# Altium project GPS_TRACKER.PrjPcb (part 1 of 2)
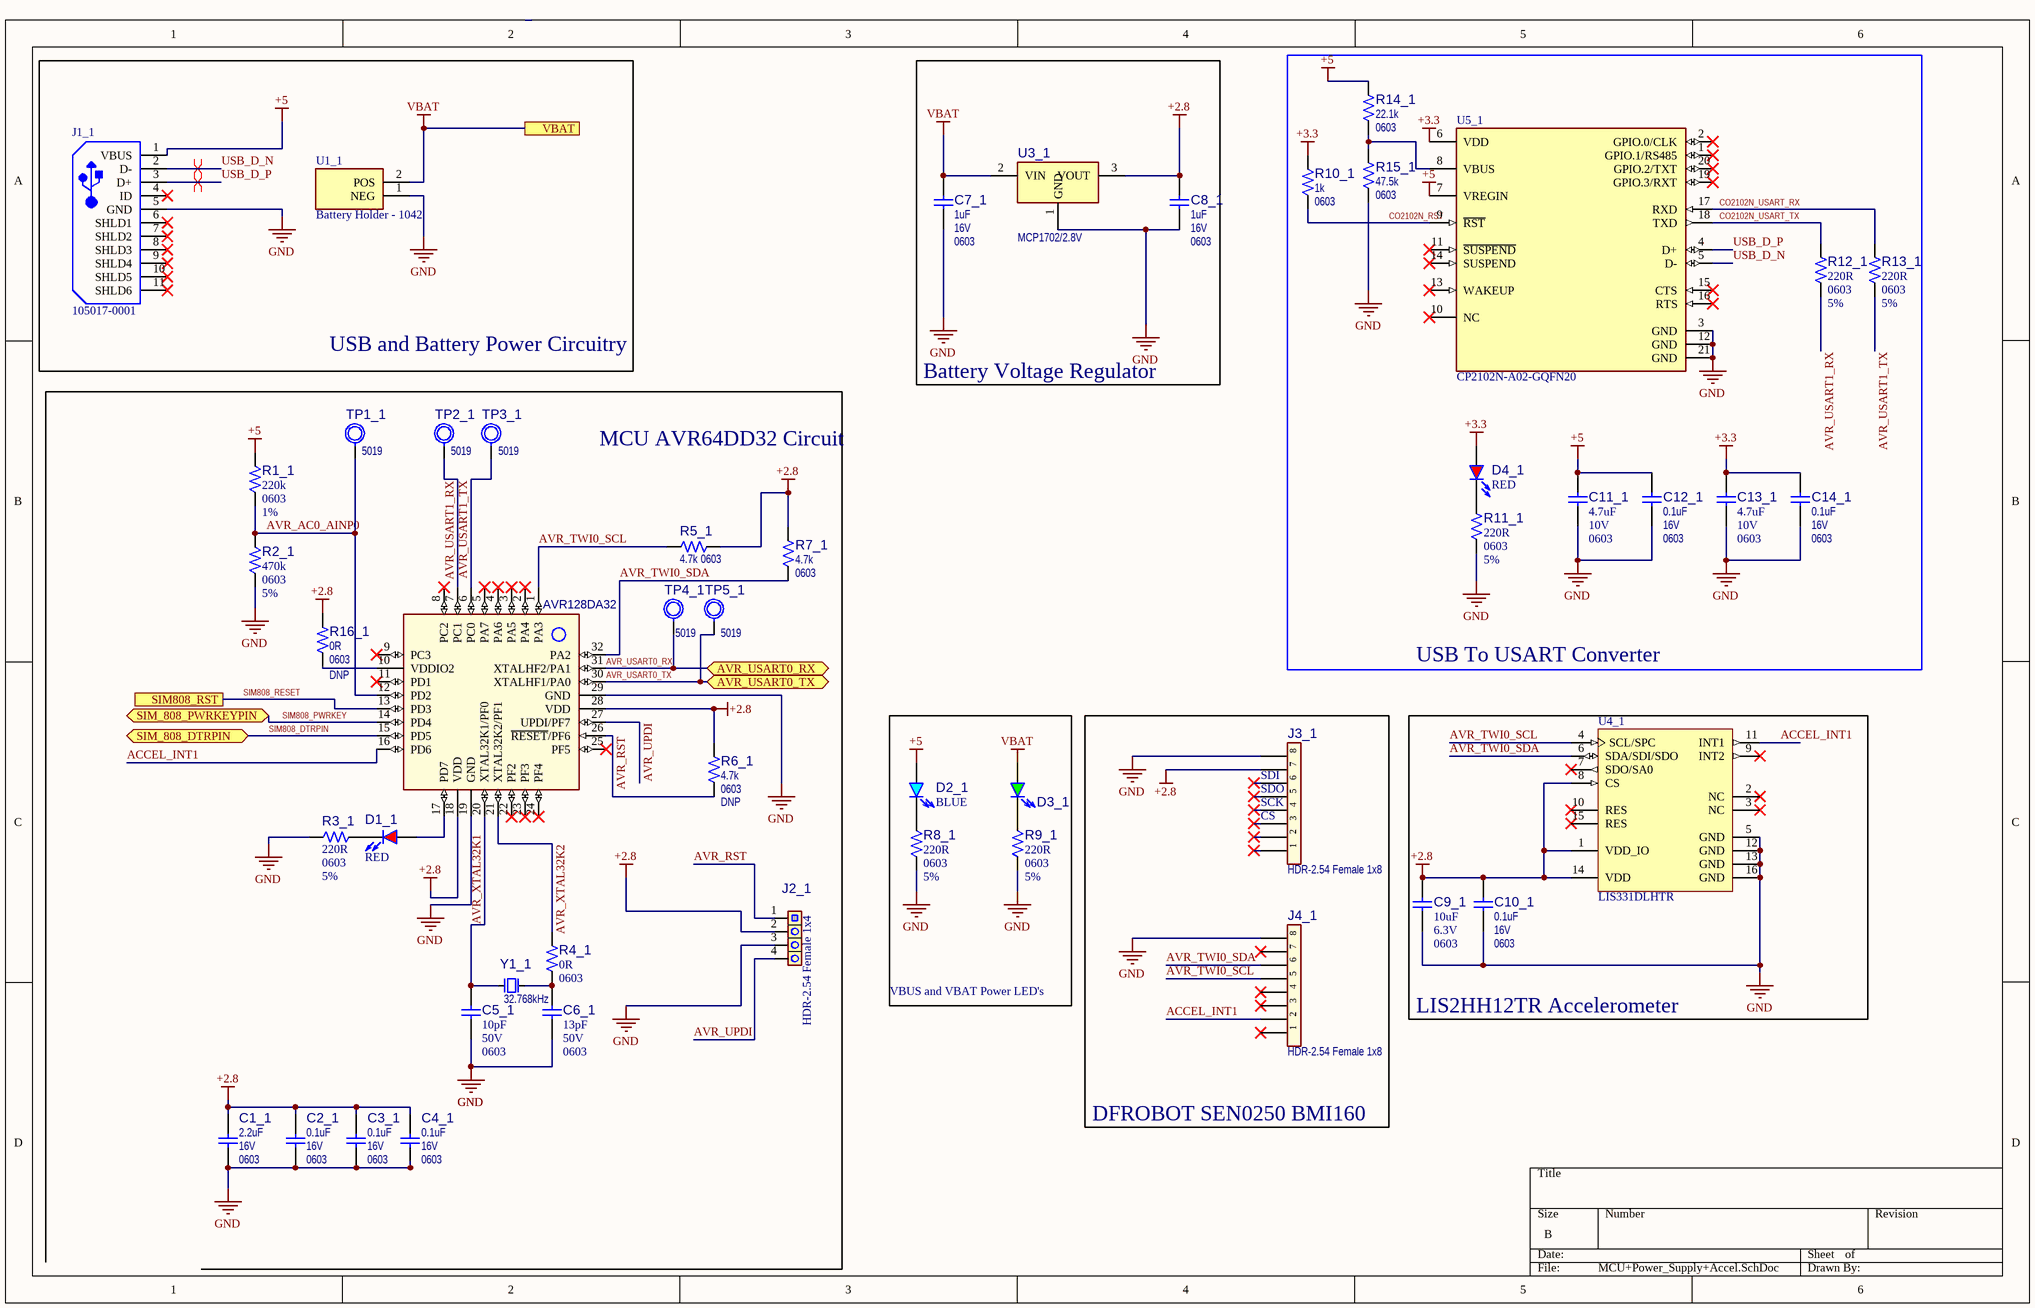
[diagram p0: MCU+Power_Supply+Accel.SchDoc]
2 sheets, 90 parts. Net scope: flat (ports and power ports of the same name join across sheets).
Board file: GPS_TRACKER.PcbDoc
Sheets:
  MCU+Power_Supply+Accel.SchDoc
  SIM808+RF.SchDoc

## Sheet MCU+Power_Supply+Accel.SchDoc
size B; SheetNumber: 1; SheetTotal: 2

### Parts
AVR128DA32  AVR128DA32-E/PT  [TQFP-32_7x7]  (value not drawn)
C1_1  value 2.2uF  Voltage: 16V  Package: 0603  [CAP_C_0603]  (hidden comment: Capacitor NP)
C2_1  value 0.1uF  Voltage: 16V  Package: 0603  [CAP_C_0603]  (hidden comment: Capacitor NP)
C3_1  value 0.1uF  Voltage: 16V  Package: 0603  [CAP_C_0603]  (hidden comment: Capacitor NP)
C4_1  value 0.1uF  Voltage: 16V  Package: 0603  [CAP_C_0603]  (hidden comment: Capacitor NP)
C5_1  value 10pF  Voltage: 50V  Package: 0603  [CAP_C_0603]  (hidden comment: Capacitor NP)
C6_1  value 13pF  Voltage: 50V  Package: 0603  [CAP_C_0603]  (hidden comment: Capacitor NP)
C7_1  value 1uF  Voltage: 16V  Package: 0603  [CAP_C_0603]  (hidden comment: Capacitor NP)
C8_1  value 1uF  Voltage: 16V  Package: 0603  [CAP_C_0603]  (hidden comment: Capacitor NP)
C9_1  value 10uF  Voltage: 6.3V  Package: 0603  [CAP_C_0603]  (hidden comment: Capacitor NP)
C10_1  value 0.1uF  Voltage: 16V  Package: 0603  [CAP_C_0603]  (hidden comment: Capacitor NP)
C11_1  value 4.7uF  Voltage: 10V  Package: 0603  [CAP_C_0603]  (hidden comment: Capacitor NP)
C12_1  value 0.1uF  Voltage: 16V  Package: 0603  [CAP_C_0603]  (hidden comment: Capacitor NP)
C13_1  value 4.7uF  Voltage: 10V  Package: 0603  [CAP_C_0603]  (hidden comment: Capacitor NP)
C14_1  value 0.1uF  Voltage: 16V  Package: 0603  [CAP_C_0603]  (hidden comment: Capacitor NP)
D1_1  value RED  [LED_0603_RED]  (hidden comment: LED_red)
D2_1  value BLUE  [LED_0603_Blue]  (hidden comment: LED_blue)
D3_1  LED_green_true  [LED_0603_Green]  (value not drawn)
D4_1  value RED  [LED_0603_RED]  (hidden comment: LED_red)
J1_1  105017-0001  [USB-MICRO-B_V]
J2_1  value HDR-2.54 Female 1x4  [HDR_F_2.54_1x4_U_TH_V_SAM_SSW-104-01-G-S]  (hidden comment: Header 1x4)
J3_1  value HDR-2.54 Female 1x8  [HDR_F_2.54_1x8]  (hidden comment: Header 1x8)
J4_1  value HDR-2.54 Female 1x8  [HDR_F_2.54_1x8]  (hidden comment: Header 1x8)
R1_1  value 220k  Package: 0603  Tolerance: 1%  [RES_C_0603]  (hidden comment: Resistor)
R2_1  value 470k  Package: 0603  Tolerance: 5%  [RES_C_0603]  (hidden comment: Resistor)
R3_1  value 220R  Package: 0603  Tolerance: 5%  [RES_C_0603]  (hidden comment: Resistor)
R4_1  value 0R  Package: 0603  [RES_C_0603]  (hidden comment: Resistor)
R5_1  value 4.7k  Package: 0603  [RES_C_0603]  (hidden comment: Resistor)
R6_1  value 4.7k  Package: 0603  Populated: DNP  [RES_C_0603]  (hidden comment: Resistor)
R7_1  value 4.7k  Package: 0603  [RES_C_0603]  (hidden comment: Resistor)
R8_1  value 220R  Package: 0603  Tolerance: 5%  [RES_C_0603]  (hidden comment: Resistor)
R9_1  value 220R  Package: 0603  Tolerance: 5%  [RES_C_0603]  (hidden comment: Resistor)
R10_1  value 1k  Package: 0603  [RES_C_0603]  (hidden comment: Resistor)
R11_1  value 220R  Package: 0603  Tolerance: 5%  [RES_C_0603]  (hidden comment: Resistor)
R12_1  value 220R  Package: 0603  Tolerance: 5%  [RES_C_0603]  (hidden comment: Resistor)
R13_1  value 220R  Package: 0603  Tolerance: 5%  [RES_C_0603]  (hidden comment: Resistor)
R14_1  value 22.1k  Package: 0603  [RES_C_0603]  (hidden comment: Resistor)
R15_1  value 47.5k  Package: 0603  [RES_C_0603]  (hidden comment: Resistor)
R16_1  value 0R  Package: 0603  Populated: DNP  [RES_C_0603]  (hidden comment: Resistor)
TP1_1  value 5019  [TP_3.8x2.03_SMD]  (hidden comment: Test Point)
TP2_1  value 5019  [TP_3.8x2.03_SMD]  (hidden comment: Test Point)
TP3_1  value 5019  [TP_3.8x2.03_SMD]  (hidden comment: Test Point)
TP4_1  value 5019  [TP_3.8x2.03_SMD]  (hidden comment: Test Point)
TP5_1  value 5019  [TP_3.8x2.03_SMD]  (hidden comment: Test Point)
U1_1  Battery Holder - 1042  [KEYSTONE-1042]
U3_1  value MCP1702/2.8V  [SOT-89-3]  (hidden comment: MCP170X SOT-89-3_TO-92-3)
U4_1  LIS331DLHTR  [STM-LGA16-3X3X1]
U5_1  CP2102N-A02-GQFN20  [FP-CP2102N-A02-GQFN20-MFG]
Y1_1  value 32.768kHz  [CRYSTAL_FX135A_L3.2W1.5H0.9]  (hidden comment: Crystal 2 Pins)

### Blocks framed on the sheet
USB and Battery Power Circuitry: J1_1 U1_1
Battery Voltage Regulator: C7_1 C8_1 U3_1
USB To USART Converter: C11_1 C12_1 C13_1 C14_1 D4_1 R10_1 R11_1 R12_1 R13_1 R14_1 R15_1 U5_1
VBUS and VBAT Power LED's: D2_1 D3_1 R8_1 R9_1
DFROBOT SEN0250 BMI160: J3_1 J4_1
LIS2HH12TR Accelerometer: C9_1 C10_1 U4_1

### Ports
AVR_USART0_RX (bidir), AVR_USART0_TX (bidir), SIM808_RST, SIM_808_DTRPIN (bidir), SIM_808_PWRKEYPIN (bidir), VBAT

### Nets
+2.8: AVR128DA32.18(VDD) AVR128DA32.28(VDD) C1_1.2 C2_1.2 C3_1.2 C4_1.2 C8_1.2 C9_1.2 C10_1.2 J2_1.2 J3_1.7 R5_1.2 R6_1.2 R7_1.2 R16_1.1 U3_1.3(VOUT) U4_1.1(VDD_IO) U4_1.8(CS) U4_1.14(VDD)
+3.3: C13_1.2 C14_1.2 D4_1.1(A) R10_1.2 U5_1.6(VDD)
+5: C11_1.2 C12_1.2 D2_1.1(A) J1_1.1(VBUS) R1_1.2 R14_1.2 U5_1.7(VREGIN)
GND: AVR128DA32.19(GND) AVR128DA32.29(GND) C1_1.1 C2_1.1 C3_1.1 C4_1.1 C5_1.1 C6_1.1 C7_1.1 C8_1.1 C9_1.1 C10_1.1 C11_1.1 C12_1.1 C13_1.1 C14_1.1 J1_1.5(GND) J2_1.3 J3_1.8 J4_1.8 R2_1.2 R3_1.2 R8_1.1 R9_1.1 R11_1.1 R15_1.1 U1_1.1(NEG) U3_1.1(GND) U4_1.5(GND) U4_1.12(GND) U4_1.13(GND) U4_1.16(GND) U5_1.3(GND) U5_1.12(GND) U5_1.21(GND)
VBAT: C7_1.2 D3_1.1(A) U1_1.2(POS) U3_1.2(VIN) ; port VBAT
ACCEL_INT1: AVR128DA32.16(PD6) J4_1.2 U4_1.11(INT1)
AVR_AC0_AINP0: AVR128DA32.12(PD2) R1_1.1 R2_1.1 TP1_1.1
AVR_RST: AVR128DA32.26(~{RESET}/PF6) J2_1.1 R6_1.1
AVR_TWI0_SCL: AVR128DA32.1(PA3) J4_1.5 R5_1.1 U4_1.4(SCL/SPC)
AVR_TWI0_SDA: AVR128DA32.32(PA2) J4_1.6 R7_1.1 U4_1.6(SDA/SDI/SDO)
AVR_UPDI: AVR128DA32.27(UPDI/PF7) J2_1.4
AVR_USART0_RX: AVR128DA32.31(XTALHF2/PA1) TP4_1.1 ; port AVR_USART0_RX
AVR_USART0_TX: AVR128DA32.30(XTALHF1/PA0) TP5_1.1 ; port AVR_USART0_TX
AVR_USART1_RX: AVR128DA32.7(PC1) R12_1.1 TP2_1.1
AVR_USART1_TX: AVR128DA32.6(PC0) R13_1.1 TP3_1.1
AVR_XTAL32K1: AVR128DA32.20(XTAL32K1/PF0) C5_1.2 Y1_1.1(Osc1)
AVR_XTAL32K2: AVR128DA32.21(XTAL32K2/PF1) R4_1.2
CO2102N_RST: R10_1.1 U5_1.9(~{RST})
CO2102N_USART_RX: R13_1.2 U5_1.17(RXD)
CO2102N_USART_TX: R12_1.2 U5_1.18(TXD)
SIM808_DTRPIN: AVR128DA32.15(PD5) ; port SIM_808_DTRPIN
SIM808_PWRKEY: AVR128DA32.14(PD4) ; port SIM_808_PWRKEYPIN
SIM808_RESET: AVR128DA32.13(PD3) ; port SIM808_RST  [project net ]
USB_D_N: J1_1.2(D-) U5_1.5(D-)
USB_D_P: J1_1.3(D+) U5_1.4(D+)
NetAVR128DA32_10: AVR128DA32.10(VDDIO2) R16_1.2
NetAVR128DA32_17: AVR128DA32.17(PD7) D1_1.1(A)
NetC6_1_2: C6_1.2 R4_1.1 Y1_1.2(Osc2)
NetD1_1_2: D1_1.2(K) R3_1.1
NetD2_1_2: D2_1.2(K) R8_1.2
NetD3_1_2: D3_1.2(K) R9_1.2
NetD4_1_2: D4_1.2(K) R11_1.2
NetR14_1_1: R14_1.1 R15_1.2 U5_1.8(VBUS)

Not connected (* = marked no-connect by the designer): AVR128DA32 2(PA4)* 3(PA5)* 4(PA6)* 5(PA7)* 8(PC2)* 9(PC3)* 11(PD1)* 22(PF2)* 23(PF3)* 24(PF4)* 25(PF5)*; J1_1 4(ID)* 6(SHLD1)* 7(SHLD2)* 8(SHLD3)* 9(SHLD4)* 10(SHLD5)* 11(SHLD6)*; J3_1 1* 2* 3* 4* 5* 6*; J4_1 1* 3* 4* 7*; U4_1 2(NC)* 3(NC)* 7(SDO/SA0)* 9(INT2)* 10(RES)* 15(RES)*; U5_1 1(GPIO.1/RS485)* 2(GPIO.0/CLK)* 10(NC)* 11(~{SUSPEND})* 13(WAKEUP)* 14(SUSPEND)* 15(CTS)* 16(RTS)* 19(GPIO.3/RXT)* 20(GPIO.2/TXT)*

### Layout directives
differential pair; net class DIFF_USB: USB_D_N, USB_D_P

### Notes on the sheet
- MCU AVR64DD32 Circuit
- (near J3_1) SDI
- (near J3_1) SDO
- (near J3_1) SCK
- (near J3_1) CS

### Library data of the parts
AVR128DA32 = MIC9190: Manufacturer 1: Microchip Technology; Manufacturer Part Number 1: AVR64DD32-I/PT; Description_: MCHP MCU 8-bit 24MHz 64KB 8KB AVR64DD32-I/PT TQFP-32; Dev Tools Status: Production; Owner: Simen Tanbergmoen; Populated: YES; MCHP-ID: MIC9190; Symbol: AVR64DD32 TQFP-32; Type: 8-Bit; Status: MCL Design; Revision: 1; Category: MCHP-Microcontroller; ComponentLink1URL: https://chn-vm-apps.microchip.com/mchprepo/parts/Datasheets/AVR64DD3228 Advance DataSheet=1=Microchip PDF=en-US.pdf; ComponentLink1Description: SVN Datasheet; ComponentLink2URL: C:\ALTIUM_WORK\00001_MCHP-CDB\Datasheets\AVR64DD3228 Advance DataSheet=1=Microchip PDF=en-US.pdf; ComponentLink2Description: Local Datasheet; ComponentLink3URL: C:\ALTIUM_WORK\00001_MCHP-CDB\Library\LibraryRefs\AVR64DD32 TQFP-32.SchLib; ComponentLink3Description: Open Symbol; ComponentLink4URL: C:\ALTIUM_WORK\00001_MCHP-CDB\Library\Footprints\TQFP-32_7x7.PcbLib; ComponentLink4Description: Open Footprint; ComponentLink5Description: Open Footprint 2; ComponentLink6Description: Open Footprint 3; ComponentLink7Description: Open Footprint 4; Supplier 1: Microchip Technology; Supplier Part Number 1: AVR64DD32-I/PT; Operating Temperature: -40C to +85C; Quantity Override: 1
C1_1 = CAP0597: Manufacturer 1: TDK Corporation; Manufacturer Part Number 1: C1608X5R1C225K080AB; Description_: CAP CER 2.2uF 16V 10% X5R SMD 0603; Dev Tools Status: Production; Tolerance: 10%; Temperature Coefficient: X5R; Type: Ceramic; Populated: Yes; MCHP-ID: CAP0597; Revision: 6; Symbol: Capacitor NP; Status: MCL Design; ComponentLink1URL: https://chn-vm-apps.microchip.com/mchprepo/parts/Datasheets/general_B11.pdf; ComponentLink1Description: SVN Datasheet; ComponentLink2URL: C:\ALTIUM_WORK\00001_MCHP-CDB\Datasheets\general_B11.pdf; ComponentLink2Description: Local Datasheet; ComponentLink3URL: C:\ALTIUM_WORK\00001_MCHP-CDB\Library\LibraryRefs\Capacitor NP.SchLib; ComponentLink3Description: Open Symbol; ComponentLink4URL: C:\ALTIUM_WORK\00001_MCHP-CDB\Library\Footprints\CAP_C_0603.PcbLib; ComponentLink4Description: Open Footprint; ComponentLink5Description: Open Footprint 2; ComponentLink6Description: Open Footprint 3; ComponentLink7Description: Open Footprint 4; Operating Temperature: -55C to +85C; Category: Capacitor; Supplier 1: Digi-Key; Supplier Part Number 1: 445-5157-1-ND; Quantity Override: 1
C2_1 C3_1 C4_1 C10_1 C12_1 C14_1 = CAP0011: Manufacturer 1: Taiyo Yuden; Manufacturer Part Number 1: EMK107B7104KA-T; Description_: CAP CER 0.1uF 16V 10% X7R SMD 0603; Dev Tools Status: Production; Tolerance: 10%; Temperature Coefficient: X7R; Type: Ceramic; Owner: Cristian Papuc; Populated: YES; MCHP-ID: CAP0011; Revision: 6; Symbol: Capacitor NP; Status: MCL Design; ComponentLink1URL: https://chn-vm-apps.microchip.com/mchprepo/parts/Datasheets/nmc2.pdf; ComponentLink1Description: SVN Datasheet; ComponentLink2URL: C:\ALTIUM_WORK\00001_MCHP-CDB\Datasheets\nmc2.pdf; ComponentLink2Description: Local Datasheet; ComponentLink3URL: C:\ALTIUM_WORK\00001_MCHP-CDB\Library\LibraryRefs\Capacitor NP.SchLib; ComponentLink3Description: Open Symbol; ComponentLink4URL: C:\ALTIUM_WORK\00001_MCHP-CDB\Library\Footprints\CAP_C_0603.PcbLib; ComponentLink4Description: Open Footprint; ComponentLink5Description: Open Footprint 2; ComponentLink6Description: Open Footprint 3; ComponentLink7Description: Open Footprint 4; Operating Temperature: -55C to +125C; Category: Capacitor; Manufacturer 2: D1_Murata Electronics North America; Manufacturer Part Number 2: GCM188R71C104KA37D; Manufacturer 3: D5_AVX; Manufacturer Part Number 3: 0603YC104KAT2A; Manufacturer 4: Samsung Electro-Mechanics; Manufacturer Part Number 4: CL10B104KO8NNNC; Manufacturer 5: Taiyo Yuden; Manufacturer Part Number 5: EMK107B7104KA-T; Manufacturer 6: Würth Elektronik; Manufacturer Part Number 6: 885012206046; Manufacturer 7: Yageo; Manufacturer Part Number 7: CC0603KRX7R7BB104; Supplier 1: Newark; Supplier Part Number 1: 86H5248; Supplier 2: Digi-Key; Supplier Part Number 2: 490-4774-1-ND; Supplier 3: Digi-Key; Supplier Part Number 3: 478-1239-1-ND; Supplier 4: Digi-Key; Supplier Part Number 4: 1276-1005-1-ND; Supplier 5: Digi-Key; Supplier Part Number 5: 587-1240-1-ND; Supplier 6: Digi-Key; Supplier Part Number 6: 732-7965-1-ND; Supplier 7: Digi-Key; Supplier Part Number 7: 311-1088-1-ND; Quantity Override: 1
C5_1 = CAP2488: Manufacturer 1: Würth Elektronik; Manufacturer Part Number 1: 885012006051; Description_: CAP CER 10pF 5% 50V C0G SMD 0603; Dev Tools Status: Design; Tolerance: 5%; Temperature Coefficient: C0G; Type: Ceramic; Owner: Cristina Salanti; Populated: YES; MCHP-ID: CAP2488; Revision: 2; Symbol: Capacitor NP; Status: MCL Design; ComponentLink1URL: https://chn-vm-apps.microchip.com/mchprepo/parts/Datasheets/885012006051.pdf; ComponentLink1Description: SVN Datasheet; ComponentLink2URL: C:\ALTIUM_WORK\00001_MCHP-CDB\Datasheets\885012006051.pdf; ComponentLink2Description: Local Datasheet; ComponentLink3URL: C:\ALTIUM_WORK\00001_MCHP-CDB\Library\LibraryRefs\Capacitor NP.SchLib; ComponentLink3Description: Open Symbol; ComponentLink4URL: C:\ALTIUM_WORK\00001_MCHP-CDB\Library\Footprints\CAP_C_0603.PcbLib; ComponentLink4Description: Open Footprint; ComponentLink5Description: Open Footprint 2; ComponentLink6Description: Open Footprint 3; ComponentLink7Description: Open Footprint 4; Operating Temperature: -55C to +125C; Category: Capacitor; Supplier 1: Digi-Key; Supplier Part Number 1: 732-7793-1-ND; Quantity Override: 1
C6_1 = CAP2468: Manufacturer 1: Yageo; Manufacturer Part Number 1: CC0603GRNPO9BN130; Description_: Ceramic capacitor, SMD 0603, 13pF, NP0, 50V, +/-2%; Dev Tools Status: Design; Tolerance: 2%; Temperature Coefficient: NP0; Type: Ceramic; Owner: Dragos Danaila; Populated: YES; MCHP-ID: CAP2468; Revision: 2; Symbol: Capacitor NP; Status: MCL Design; ComponentLink1URL: https://chn-vm-apps.microchip.com/mchprepo/parts/Datasheets/UPY-GP_NP0_16V-to-50V_18.pdf; ComponentLink1Description: SVN Datasheet; ComponentLink2URL: C:\ALTIUM_WORK\00001_MCHP-CDB\Datasheets\UPY-GP_NP0_16V-to-50V_18.pdf; ComponentLink2Description: Local Datasheet; ComponentLink3URL: C:\ALTIUM_WORK\00001_MCHP-CDB\Library\LibraryRefs\Capacitor NP.SchLib; ComponentLink3Description: Open Symbol; ComponentLink4URL: C:\ALTIUM_WORK\00001_MCHP-CDB\Library\Footprints\CAP_C_0603.PcbLib; ComponentLink4Description: Open Footprint; ComponentLink5Description: Open Footprint 2; ComponentLink6Description: Open Footprint 3; ComponentLink7Description: Open Footprint 4; Operating Temperature: -55C to +125C; Category: Capacitor; Supplier 1: Digi-Key; Supplier Part Number 1: 311-3919-1-ND; Quantity Override: 1
C7_1 C8_1 = CAP0265: Manufacturer 1: D5_AVX; Manufacturer Part Number 1: 0603YD105KAT2A; Description_: CAP CER 1uF 16V 10% X5R SMD 0603; Dev Tools Status: Production; Tolerance: 10%; Temperature Coefficient: X5R; Type: Ceramic; Populated: Yes; MCHP-ID: CAP0265; Revision: 6; Symbol: Capacitor NP; Status: MCL Design; ComponentLink1URL: https://chn-vm-apps.microchip.com/mchprepo/parts/Datasheets/smccp.pdf; ComponentLink1Description: SVN Datasheet; ComponentLink2URL: C:\ALTIUM_WORK\00001_MCHP-CDB\Datasheets\smccp.pdf; ComponentLink2Description: Local Datasheet; ComponentLink3URL: C:\ALTIUM_WORK\00001_MCHP-CDB\Library\LibraryRefs\Capacitor NP.SchLib; ComponentLink3Description: Open Symbol; ComponentLink4URL: C:\ALTIUM_WORK\00001_MCHP-CDB\Library\Footprints\CAP_C_0603.PcbLib; ComponentLink4Description: Open Footprint; ComponentLink5Description: Open Footprint 2; ComponentLink6Description: Open Footprint 3; ComponentLink7Description: Open Footprint 4; Operating Temperature: -55C to +85C; Category: Capacitor; Manufacturer 2: KEMET; Manufacturer Part Number 2: C0603C105K4PACTU; Manufacturer 3: TDK Corporation; Manufacturer Part Number 3: C1608X5R1C105K080AA; Manufacturer 4: Vishay; Manufacturer Part Number 4: VJ0603G105KXJCW1BC; Manufacturer 5: Yageo; Manufacturer Part Number 5: CC0603KRX5R7BB105; Supplier 1: Digi-Key; Supplier Part Number 1: 478-1249-1-ND; Supplier 2: Digi-Key; Supplier Part Number 2: 399-5090-1-ND; Supplier 3: Digi-Key; Supplier Part Number 3: 445-1416-1-ND; Supplier 4: Digi-Key; Supplier Part Number 4: 720-1851-1-ND; Supplier 5: Digi-Key; Supplier Part Number 5: 311-1444-1-ND; Quantity Override: 1
C9_1 = CAP0533: Manufacturer 1: AVX; Manufacturer Part Number 1: 06036D106MAT2A; Description_: CAP CER 10uF 6.3V 20% X5R SMD 0603; Dev Tools Status: Production; Tolerance: 20%; Temperature Coefficient: X5R; Type: Ceramic; Populated: Yes; MCHP-ID: CAP0533; Revision: 1; Symbol: Capacitor NP; Status: MCL Design; ComponentLink1URL: https://chn-vm-apps.microchip.com/mchprepo/parts/Datasheets/smccp.pdf; ComponentLink1Description: SVN Datasheet; ComponentLink2URL: C:\ALTIUM_WORK\00001_MCHP-CDB\Datasheets\smccp.pdf; ComponentLink2Description: Local Datasheet; ComponentLink3URL: C:\ALTIUM_WORK\00001_MCHP-CDB\Library\LibraryRefs\Capacitor NP.SchLib; ComponentLink3Description: Open Symbol; ComponentLink4URL: C:\ALTIUM_WORK\00001_MCHP-CDB\Library\Footprints\CAP_C_0603.PcbLib; ComponentLink4Description: Open Footprint; ComponentLink5Description: Open Footprint 2; ComponentLink6Description: Open Footprint 3; ComponentLink7Description: Open Footprint 4; Operating Temperature: -55C to +85C; Category: Capacitor; Manufacturer 2: KEMET; Manufacturer Part Number 2: C0603C106M9PACTU; Manufacturer 3: Murata; Manufacturer Part Number 3: GRM188R60J106ME47D; Manufacturer 4: TDK Corporation; Manufacturer Part Number 4: C1608X5R0J106M080AB; Manufacturer 5: TDK Corporation; Manufacturer Part Number 5: C1608X5R0J106M; Supplier 1: Digi-Key; Supplier Part Number 1: 478-5318-2-ND; Supplier 2: Digi-Key; Supplier Part Number 2: 399-5504-1-ND; Supplier 3: Digi-Key; Supplier Part Number 3: 445-3472-1-ND; Supplier 4: Digi-Key; Supplier Part Number 4: 445-4112-1-ND; Quantity Override: 1
C11_1 C13_1 = CAP0384: Manufacturer 1: Murata; Manufacturer Part Number 1: GRM188F51A475ZE20D; Description_: CAP CER 4.7uF 10V 80% Y5V SMD 0603; Dev Tools Status: Production; Tolerance: 80%; Temperature Coefficient: Y5V; Type: Ceramic; Populated: Yes; MCHP-ID: CAP0384; Revision: 2; Symbol: Capacitor NP; Status: MCL Design; ComponentLink1URL: https://chn-vm-apps.microchip.com/mchprepo/parts/Datasheets/L0005E.pdf; ComponentLink1Description: SVN Datasheet; ComponentLink2URL: C:\ALTIUM_WORK\00001_MCHP-CDB\Datasheets\L0005E.pdf; ComponentLink2Description: Local Datasheet; ComponentLink3URL: C:\ALTIUM_WORK\00001_MCHP-CDB\Library\LibraryRefs\Capacitor NP.SchLib; ComponentLink3Description: Open Symbol; ComponentLink4URL: C:\ALTIUM_WORK\00001_MCHP-CDB\Library\Footprints\CAP_C_0603.PcbLib; ComponentLink4Description: Open Footprint; ComponentLink5Description: Open Footprint 2; ComponentLink6Description: Open Footprint 3; ComponentLink7Description: Open Footprint 4; Operating Temperature: -30C to +85C; Category: Capacitor; Manufacturer 2: Taiyo Yuden; Manufacturer Part Number 2: JMK107BJ475KA-T; Supplier 1: Digi-Key; Supplier Part Number 1: 490-3302-1-ND; Supplier 2: Digi-Key; Supplier Part Number 2: 587-1785-1-nd; Quantity Override: 1
D1_1 D4_1 = LED0063: LED; Manufacturer 1: Lite-On; Manufacturer Part Number 1: LTST-C190KRKT; Description_: DIO LED RED 1.8V 40mA 10mcd Clear SMD 0603; Dev Tools Status: Production; Type: LED Single; Forward Current: 40mA; Power: 100mW; Reverse Current: 100uA; Reverse Voltage: 5V; Populated: YES; MCHP-ID: LED0063; Revision: 1; Symbol: LED_red; Status: MCL Design; Package: 0603; ComponentLink1URL: https://chn-vm-apps.microchip.com/mchprepo/parts/Datasheets/LTST-C190CKT.pdf; ComponentLink1Description: SVN Datasheet; ComponentLink2URL: C:\ALTIUM_WORK\00001_MCHP-CDB\Datasheets\LTST-C190CKT.pdf; ComponentLink2Description: Local Datasheet; ComponentLink3URL: C:\ALTIUM_WORK\00001_MCHP-CDB\Library\LibraryRefs\LED_red.SchLib; ComponentLink3Description: Open Symbol; ComponentLink4URL: C:\ALTIUM_WORK\00001_MCHP-CDB\Library\Footprints\LED_0603_RED.PcbLib; ComponentLink4Description: Open Footprint; ComponentLink5Description: Open Footprint 2; ComponentLink6Description: Open Footprint 3; ComponentLink7Description: Open Footprint 4; Operating Temperature: -55C to +85C; Category: Diode; Manufacturer 2: Lite-On; Manufacturer Part Number 2: LTST-C190CKT; Supplier 1: Digi-Key; Supplier Part Number 1: 160-1436-1-ND; Supplier 2: Digi-Key; Supplier Part Number 2: 160-1181-1-ND; Quantity Override: 1
D2_1 = DIODE1056: LED; Manufacturer 1: Lite-On; Manufacturer Part Number 1: LTST-C193TBKT-5A; Description_: DIO LED BLUE 2.8V 20mA 15mcd Clear SMD 0603; Dev Tools Status: Production; Type: LED Single; Forward Current: 20mA; Power: 76mW; Reverse Current: 10uA; Reverse Voltage: 5V; Owner: Tad Ahlvers; Populated: YES; MCHP-ID: DIODE1056; Revision: 5; Symbol: LED_blue; Status: MCL Design; Package: 0603; ComponentLink1URL: https://chn-vm-apps.microchip.com/mchprepo/parts/Datasheets/LTST-C193TBKT-5A.pdf; ComponentLink1Description: SVN Datasheet; ComponentLink2URL: C:\ALTIUM_WORK\00001_MCHP-CDB\Datasheets\LTST-C193TBKT-5A.pdf; ComponentLink2Description: Local Datasheet; ComponentLink3URL: C:\ALTIUM_WORK\00001_MCHP-CDB\Library\LibraryRefs\LED_blue.SchLib; ComponentLink3Description: Open Symbol; ComponentLink4URL: C:\ALTIUM_WORK\00001_MCHP-CDB\Library\Footprints\LED_0603_Blue.PcbLib; ComponentLink4Description: Open Footprint; ComponentLink5Description: Open Footprint 2; ComponentLink6Description: Open Footprint 3; ComponentLink7Description: Open Footprint 4; Operating Temperature: -20C to +80C; Category: Diode; Supplier 1: Digi-Key; Supplier Part Number 1: 160-1827-1-ND; Quantity Override: 1
D3_1 = DIODE1242: LED TRUE GREEN; Manufacturer 1: Mouser; Manufacturer Part Number 1: 720-LTQ39GQ1S22515; Description_: Standard LEDs - SMD True Green; Dev Tools Status: Design; Type: LED Single; Forward Current: 5ma; Owner: Ed Kennedy; Populated: YES; MCHP-ID: DIODE1242; Revision: A; Symbol: LED_green_true; Status: MCL Design; Package: 0603; ComponentLink1URL: https://chn-vm-apps.microchip.com/mchprepo/parts/Datasheets/L(B,T) Q39G.pdf; ComponentLink1Description: SVN Datasheet; ComponentLink2URL: C:\ALTIUM_WORK\00001_MCHP-CDB\Datasheets\L(B,T) Q39G.pdf; ComponentLink2Description: Local Datasheet; ComponentLink3URL: C:\ALTIUM_WORK\00001_MCHP-CDB\Library\LibraryRefs\LED_green_true.SchLib; ComponentLink3Description: Open Symbol; ComponentLink4URL: C:\ALTIUM_WORK\00001_MCHP-CDB\Library\Footprints\LED_0603_Green.PcbLib; ComponentLink4Description: Open Footprint; ComponentLink5Description: Open Footprint 2; ComponentLink6Description: Open Footprint 3; ComponentLink7Description: Open Footprint 4; Operating Temperature: -40C to85; Category: Diode; Supplier 1: Mouser; Supplier Part Number 1: 720-LTQ39GQ1S22515; Quantity Override: 1
J1_1 = CMP-2000-05827-1: Micro-USB B Receptacle, Right Angle, Bottom Mount, Surface Mount, with Solder Tabs, -30 to 85 degC, 5-Pin USB, RoHS, Tape and Reel; Manufacturer: Molex; Featured Product: Micro-USBConnectorsUSBConnectors; Other Names: WM1399DKR; Package Version: Rev. F, 12/2012; Number of Contacts: 5; Connector Type: USB-microB; Catalog Drawings: 1050170001; 3D Model: 105017-0001.stp; Mating Products: WM17145-ND-CABLEMICROUSBBTOSTDA1.0MWM17147-ND-CABLEMICROUSBBTOSTDA2.0MWM17146-ND-CABLEMICROUSBBTOSTDA1.5M; PCN Assembly/Origin: ResinSupplier21/Oct/2015; Voltage - Max: 30V; Online Catalog: Molex-MicroUSB; Manufacturer URL: http://www.molex.com/; Package Description: 5-Leads USB, Micro B, Body 7.5 x 5 mm, Pitch 0.65 mm; Datasheet URL: http://www.molex.com/elqNow/elqRedir.htm?ref=http://www.molex.com/webdocs/datasheets/pdf/en-us/1050170001_IO_CONNECTORS.pdf; Ingress Protection: -; Datasheet Version: 03/2016; Mounting Type: BoardCutout,SurfaceMount,RightAngle; Circuits: 5; Standard Package: 1; Package Reference: MICRO-B; Package URL: http://www.molex.com/pdm_docs/sd/1050170001_sd.pdf; Category: Connectors,Interconnects; Series: -; RoHS Information: 1050170001CertofCompliance; Features: Shielded,SolderRetention; Family: USB,DVI,HDMIConnectors; Specifications: -; Gender: Receptacle; Packaging: Digi-Reel®; Mounting Technology: SurfaceMount
J2_1 = CON0066: Manufacturer 1: Samtec; Manufacturer Part Number 1: SSW-104-01-G-S; Description_: CON HDR-2.54 Female 1x4 Gold TH VERT; Dev Tools Status: Production; Owner: Randolph Sobrepena; Populated: YES; MCHP-ID: CON0066; Revision: 1; Symbol: Header 1x4; Status: MCL Design; ComponentLink1URL: https://chn-vm-apps.microchip.com/mchprepo/parts/Datasheets/ssw-1xx-xx-xxx-x-xx-xxx-xx-mkt.pdf; ComponentLink1Description: SVN Datasheet; ComponentLink2URL: C:\ALTIUM_WORK\00001_MCHP-CDB\Datasheets\ssw-1xx-xx-xxx-x-xx-xxx-xx-mkt.pdf; ComponentLink2Description: Local Datasheet; ComponentLink3URL: C:\ALTIUM_WORK\00001_MCHP-CDB\Library\LibraryRefs\Header 1x4.SchLib; ComponentLink3Description: Open Symbol; ComponentLink4URL: C:\ALTIUM_WORK\00001_MCHP-CDB\Library\Footprints\HDR_F_2.54_1x4_U_TH_V_SAM_SSW-104-01-G-S.PcbLib; ComponentLink4Description: Open Footprint; ComponentLink5Description: Open Footprint 2; ComponentLink6Description: Open Footprint 3; ComponentLink7Description: Open Footprint 4; Type: Header 2.54mm; Category: Connector; Supplier 1: Digi-Key; Supplier Part Number 1: SAM1209-04-ND; Quantity Override: 1
J3_1 J4_1 = CON1113: Manufacturer 1: Sullins; Manufacturer Part Number 1: PPTC081LFBN-RC; Description_: CON HDR-2.54 Female 1x8 Tin TH VERT; Dev Tools Status: Production; Owner: Bogdan P (M91398); Populated: Yes; MCHP-ID: CON1113; Revision: 1; Symbol: Header 1x8; Status: MCL Design; ComponentLink1Description: SVN Datasheet; ComponentLink2Description: Local Datasheet; ComponentLink3URL: C:\ALTIUM_WORK\00001_MCHP-CDB\Library\LibraryRefs\Header 1x8.SchLib; ComponentLink3Description: Open Symbol; ComponentLink4URL: C:\ALTIUM_WORK\00001_MCHP-CDB\Library\Footprints\HDR_F_2.54_1x8.PcbLib; ComponentLink4Description: Open Footprint; ComponentLink5Description: Open Footprint 2; ComponentLink6Description: Open Footprint 3; ComponentLink7Description: Open Footprint 4; Type: Header 2.54mm; Category: Connector; Manufacturer 2: SHENZHEN JUNHAO ENGINEERING; Manufacturer Part Number 2: R-212-0810-0071-000; Supplier 1: Digi-Key; Supplier Part Number 1: S7006-ND; Supplier 2: SHENZHEN JUNHAO ENGINEERING; Supplier Part Number 2: R-212-0810-0071-000; Quantity Override: 1
R1_1 = RES1144: Manufacturer 1: Panasonic; Manufacturer Part Number 1: ERJ-3EKF2203V; Description_: RES TKF 220k 1% 1/10W SMD 0603; Dev Tools Status: Production; Voltage: 75V; Temperature Coefficient: 100ppm/C; Power: 1/10W; Owner: Adrian M (M91404); Populated: Yes; MCHP-ID: RES1144; Revision: 0; Symbol: Resistor; Status: MCL Design; ComponentLink1URL: https://chn-vm-apps.microchip.com/mchprepo/parts/Datasheets/AOA0000CE2.pdf; ComponentLink1Description: SVN Datasheet; ComponentLink2URL: C:\ALTIUM_WORK\00001_MCHP-CDB\Datasheets\AOA0000CE2.pdf; ComponentLink2Description: Local Datasheet; ComponentLink3URL: C:\ALTIUM_WORK\00001_MCHP-CDB\Library\LibraryRefs\Resistor.SchLib; ComponentLink3Description: Open Symbol; ComponentLink4URL: C:\ALTIUM_WORK\00001_MCHP-CDB\Library\Footprints\RES_C_0603.PcbLib; ComponentLink4Description: Open Footprint; ComponentLink5Description: Open Footprint 2; ComponentLink6Description: Open Footprint 3; ComponentLink7Description: Open Footprint 4; Operating Temperature: -55C to +155C; Category: Resistor; Type: RES SMD; Composition: TKF; Supplier 1: Digi-Key; Supplier Part Number 1: P220KHCT-ND; Quantity Override: 1
R2_1 = RES1184: Manufacturer 1: Panasonic; Manufacturer Part Number 1: ERJ-3GEYJ474V; Description_: RES TKF 470k 5% 1/10W SMD 0603; Dev Tools Status: Production; Voltage: 75V; Temperature Coefficient: 200ppm/C; Power: 1/10W; Owner: Adrian T (M91397); Populated: Yes; MCHP-ID: RES1184; Revision: 0; Symbol: Resistor; Status: MCL Design; ComponentLink1URL: https://chn-vm-apps.microchip.com/mchprepo/parts/Datasheets/AOA0000CE1.pdf; ComponentLink1Description: SVN Datasheet; ComponentLink2URL: C:\ALTIUM_WORK\00001_MCHP-CDB\Datasheets\AOA0000CE1.pdf; ComponentLink2Description: Local Datasheet; ComponentLink3URL: C:\ALTIUM_WORK\00001_MCHP-CDB\Library\LibraryRefs\Resistor.SchLib; ComponentLink3Description: Open Symbol; ComponentLink4URL: C:\ALTIUM_WORK\00001_MCHP-CDB\Library\Footprints\RES_C_0603.PcbLib; ComponentLink4Description: Open Footprint; ComponentLink5Description: Open Footprint 2; ComponentLink6Description: Open Footprint 3; ComponentLink7Description: Open Footprint 4; Operating Temperature: -55C to +155C; Category: Resistor; Type: RES SMD; Composition: TKF; Supplier 1: Digi-Key; Supplier Part Number 1: P470KGCT-ND; Quantity Override: 1
R3_1 R8_1 R9_1 R11_1 R12_1 R13_1 = RES0194: Manufacturer 1: ROHM; Manufacturer Part Number 1: MCR03EZPJ221; Description_: RES TKF 220R 5% 1/10W SMD 0603; Dev Tools Status: Production; Voltage: 50V; Temperature Coefficient: 100ppm/C; Power: 1/10W; Populated: Yes; MCHP-ID: RES0194; Revision: 1; Symbol: Resistor; Status: MCL Design; ComponentLink1URL: https://chn-vm-apps.microchip.com/mchprepo/parts/Datasheets/mcr_a.pdf; ComponentLink1Description: SVN Datasheet; ComponentLink2URL: C:\ALTIUM_WORK\00001_MCHP-CDB\Datasheets\mcr_a.pdf; ComponentLink2Description: Local Datasheet; ComponentLink3URL: C:\ALTIUM_WORK\00001_MCHP-CDB\Library\LibraryRefs\Resistor.SchLib; ComponentLink3Description: Open Symbol; ComponentLink4URL: C:\ALTIUM_WORK\00001_MCHP-CDB\Library\Footprints\RES_C_0603.PcbLib; ComponentLink4Description: Open Footprint; ComponentLink5Description: Open Footprint 2; ComponentLink6Description: Open Footprint 3; ComponentLink7Description: Open Footprint 4; Operating Temperature: -55C to +155C; Category: Resistor; Type: RES SMD; Composition: TKF; Supplier 1: Digi-Key; Supplier Part Number 1: RHM220GCT-ND; Quantity Override: 1
R4_1 = RES2360: Manufacturer 1: Panasonic Electronic Components; Manufacturer Part Number 1: ERJ-3GEY0R00V; Description_: RES TKF 0R 1/10W SMD 0603 AEC-Q200; Dev Tools Status: Production; Circuit Type: Isolated; Power: 1/10W; Owner: Steve Dziaba; Populated: YES; MCHP-ID: RES2360; Revision: 1; Symbol: Resistor; Status: MCL Design; ComponentLink1URL: https://chn-vm-apps.microchip.com/mchprepo/parts/Datasheets/ERJ-3GEY0R00V.pdf; ComponentLink1Description: SVN Datasheet; ComponentLink2URL: C:\ALTIUM_WORK\00001_MCHP-CDB\Datasheets\ERJ-3GEY0R00V.pdf; ComponentLink2Description: Local Datasheet; ComponentLink3URL: C:\ALTIUM_WORK\00001_MCHP-CDB\Library\LibraryRefs\Resistor.SchLib; ComponentLink3Description: Open Symbol; ComponentLink4URL: C:\ALTIUM_WORK\00001_MCHP-CDB\Library\Footprints\RES_C_0603.PcbLib; ComponentLink4Description: Open Footprint; ComponentLink5Description: Open Footprint 2; ComponentLink6Description: Open Footprint 3; ComponentLink7Description: Open Footprint 4; Category: Resistor; Type: RES SMD; Composition: TKF; Manufacturer 2: Vishay; Manufacturer Part Number 2: CRCW06030000Z0EB; Supplier 1: Digi-Key; Supplier Part Number 1: P0.0GCT-ND; Supplier 2: Digi-Key; Supplier Part Number 2: 541-2968-1-ND; Quantity Override: 1
R5_1 R7_1 = RES1178: Manufacturer 1: Panasonic; Manufacturer Part Number 1: ERJ-3GEYJ472V; Description_: RES TKF 4.7k 5% 1/10W SMD 0603; Dev Tools Status: Production; Voltage: 75V; Temperature Coefficient: 200ppm/C; Power: 1/10W; Owner: Bogdan P (M91398); Populated: Yes; MCHP-ID: RES1178; Revision: 0; Symbol: Resistor; Status: MCL Design; ComponentLink1URL: https://chn-vm-apps.microchip.com/mchprepo/parts/Datasheets/AOA0000CE1.pdf; ComponentLink1Description: SVN Datasheet; ComponentLink2URL: C:\ALTIUM_WORK\00001_MCHP-CDB\Datasheets\AOA0000CE1.pdf; ComponentLink2Description: Local Datasheet; ComponentLink3URL: C:\ALTIUM_WORK\00001_MCHP-CDB\Library\LibraryRefs\Resistor.SchLib; ComponentLink3Description: Open Symbol; ComponentLink4URL: C:\ALTIUM_WORK\00001_MCHP-CDB\Library\Footprints\RES_C_0603.PcbLib; ComponentLink4Description: Open Footprint; ComponentLink5Description: Open Footprint 2; ComponentLink6Description: Open Footprint 3; ComponentLink7Description: Open Footprint 4; Operating Temperature: -55C to +155C; Category: Resistor; Type: RES SMD; Composition: TKF; Supplier 1: Digi-Key; Supplier Part Number 1: P4.7KGCT-ND; Quantity Override: 1
R6_1 = RES1178: Manufacturer 1: Panasonic; Manufacturer Part Number 1: ERJ-3GEYJ472V; Description_: RES TKF 4.7k 5% 1/10W SMD 0603; Dev Tools Status: Production; Voltage: 75V; Temperature Coefficient: 200ppm/C; Power: 1/10W; Owner: Bogdan P (M91398); MCHP-ID: RES1178; Revision: 0; Symbol: Resistor; Status: MCL Design; ComponentLink1URL: https://chn-vm-apps.microchip.com/mchprepo/parts/Datasheets/AOA0000CE1.pdf; ComponentLink1Description: SVN Datasheet; ComponentLink2URL: C:\ALTIUM_WORK\00001_MCHP-CDB\Datasheets\AOA0000CE1.pdf; ComponentLink2Description: Local Datasheet; ComponentLink3URL: C:\ALTIUM_WORK\00001_MCHP-CDB\Library\LibraryRefs\Resistor.SchLib; ComponentLink3Description: Open Symbol; ComponentLink4URL: C:\ALTIUM_WORK\00001_MCHP-CDB\Library\Footprints\RES_C_0603.PcbLib; ComponentLink4Description: Open Footprint; ComponentLink5Description: Open Footprint 2; ComponentLink6Description: Open Footprint 3; ComponentLink7Description: Open Footprint 4; Operating Temperature: -55C to +155C; Category: Resistor; Type: RES SMD; Composition: TKF; Supplier 1: Digi-Key; Supplier Part Number 1: P4.7KGCT-ND; Quantity Override: 1
R10_1 = RES1015: Manufacturer 1: Panasonic - ECG; Manufacturer Part Number 1: ERA-3AEB102V; Description_: RES TF 1k 0.1% 1/10W SMD 0603; Dev Tools Status: Production; Voltage: 75V; Temperature Coefficient: 25ppm/C; Power: 1/10W; Owner: Tad Ahlvers; Populated: YES; MCHP-ID: RES1015; Revision: 1; Symbol: Resistor; Status: MCL Design; ComponentLink1URL: https://chn-vm-apps.microchip.com/mchprepo/parts/Datasheets/AOA0000CE26.pdf; ComponentLink1Description: SVN Datasheet; ComponentLink2URL: C:\ALTIUM_WORK\00001_MCHP-CDB\Datasheets\AOA0000CE26.pdf; ComponentLink2Description: Local Datasheet; ComponentLink3URL: C:\ALTIUM_WORK\00001_MCHP-CDB\Library\LibraryRefs\Resistor.SchLib; ComponentLink3Description: Open Symbol; ComponentLink4URL: C:\ALTIUM_WORK\00001_MCHP-CDB\Library\Footprints\RES_C_0603.PcbLib; ComponentLink4Description: Open Footprint; ComponentLink5Description: Open Footprint 2; ComponentLink6Description: Open Footprint 3; ComponentLink7Description: Open Footprint 4; Operating Temperature: -55C to +155C; Category: Resistor; Type: RES SMD; Composition: TF; Manufacturer 2: TE Connectivity; Manufacturer Part Number 2: 1614882-3; Supplier 1: Digi-Key; Supplier Part Number 1: P1.0KDBTR-ND; Supplier 2: Digi-Key; Supplier Part Number 2: A102332TR-ND; Quantity Override: 1
R14_1 = RES2774: Manufacturer 1: Panasonic Electronic Components; Manufacturer Part Number 1: ERA-3AEB2212V; Description_: RES TF 22.1k 0.1% 1/10W SMD 0603 AEC-Q200; Dev Tools Status: Design; Voltage: 75V; Temperature Coefficient: 25ppm/C; Power: 1/10W; Owner: Kamatchi Sundaresan; Populated: YES; MCHP-ID: RES2774; Revision: A; Symbol: Resistor; Status: MCL Design; ComponentLink1URL: https://chn-vm-apps.microchip.com/mchprepo/parts/Datasheets/AOA0000C307.pdf; ComponentLink1Description: SVN Datasheet; ComponentLink2URL: C:\ALTIUM_WORK\00001_MCHP-CDB\Datasheets\AOA0000C307.pdf; ComponentLink2Description: Local Datasheet; ComponentLink3URL: C:\ALTIUM_WORK\00001_MCHP-CDB\Library\LibraryRefs\Resistor.SchLib; ComponentLink3Description: Open Symbol; ComponentLink4URL: C:\ALTIUM_WORK\00001_MCHP-CDB\Library\Footprints\RES_C_0603.PcbLib; ComponentLink4Description: Open Footprint; ComponentLink5Description: Open Footprint 2; ComponentLink6Description: Open Footprint 3; ComponentLink7Description: Open Footprint 4; Operating Temperature: -55C to +155C; Category: Resistor; Type: RES SMD; Composition: TF; Supplier 1: Digi-Key; Supplier Part Number 1: P22.1KDBCT-ND; Quantity Override: 1
R15_1 = RES1543: Manufacturer 1: Vishay; Manufacturer Part Number 1: CRCW060347K5FKEA; Description_: RES TKF 47.5k 1% 1/10W SMD 0603; Dev Tools Status: Production; Temperature Coefficient: ±100ppm/°C; Power: 1/10W; Owner: Sam Charles; Populated: YES; MCHP-ID: RES1543; Revision: 2; Symbol: Resistor; Status: MCL Design; ComponentLink1URL: https://chn-vm-apps.microchip.com/mchprepo/parts/Datasheets/dcrcwe3.pdf; ComponentLink1Description: SVN Datasheet; ComponentLink2URL: C:\ALTIUM_WORK\00001_MCHP-CDB\Datasheets\dcrcwe3.pdf; ComponentLink2Description: Local Datasheet; ComponentLink3URL: C:\ALTIUM_WORK\00001_MCHP-CDB\Library\LibraryRefs\Resistor.SchLib; ComponentLink3Description: Open Symbol; ComponentLink4URL: C:\ALTIUM_WORK\00001_MCHP-CDB\Library\Footprints\RES_C_0603.PcbLib; ComponentLink4Description: Open Footprint; ComponentLink5Description: Open Footprint 2; ComponentLink6Description: Open Footprint 3; ComponentLink7Description: Open Footprint 4; Operating Temperature: -55°C ~ 155°C; Category: Resistor; Type: RES SMD; Composition: TKF; Supplier 1: Digi-Key; Supplier Part Number 1: 541-47.5KHCT-ND; Quantity Override: 1
R16_1 = RES2360: Manufacturer 1: Panasonic Electronic Components; Manufacturer Part Number 1: ERJ-3GEY0R00V; Description_: RES TKF 0R 1/10W SMD 0603 AEC-Q200; Dev Tools Status: Production; Circuit Type: Isolated; Power: 1/10W; Owner: Steve Dziaba; MCHP-ID: RES2360; Revision: 1; Symbol: Resistor; Status: MCL Design; ComponentLink1URL: https://chn-vm-apps.microchip.com/mchprepo/parts/Datasheets/ERJ-3GEY0R00V.pdf; ComponentLink1Description: SVN Datasheet; ComponentLink2URL: C:\ALTIUM_WORK\00001_MCHP-CDB\Datasheets\ERJ-3GEY0R00V.pdf; ComponentLink2Description: Local Datasheet; ComponentLink3URL: C:\ALTIUM_WORK\00001_MCHP-CDB\Library\LibraryRefs\Resistor.SchLib; ComponentLink3Description: Open Symbol; ComponentLink4URL: C:\ALTIUM_WORK\00001_MCHP-CDB\Library\Footprints\RES_C_0603.PcbLib; ComponentLink4Description: Open Footprint; ComponentLink5Description: Open Footprint 2; ComponentLink6Description: Open Footprint 3; ComponentLink7Description: Open Footprint 4; Category: Resistor; Type: RES SMD; Composition: TKF; Manufacturer 2: Vishay; Manufacturer Part Number 2: CRCW06030000Z0EB; Supplier 1: Digi-Key; Supplier Part Number 1: P0.0GCT-ND; Supplier 2: Digi-Key; Supplier Part Number 2: 541-2968-1-ND; Quantity Override: 1
TP1_1 TP2_1 TP3_1 TP4_1 TP5_1 = CON1252: Manufacturer 1: Keystone Electronics; Description_: CON TP TAB Silver Mini 3.8x2.03 SMD; Dev Tools Status: Production; Owner: Jairuz Agang-ang; Populated: YES; MCHP-ID: CON1252; Revision: 1; Symbol: Test Point; Status: MCL Design; ComponentLink1URL: https://chn-vm-apps.microchip.com/mchprepo/parts/Datasheets/M60-2p61.pdf; ComponentLink1Description: SVN Datasheet; ComponentLink2URL: C:\ALTIUM_WORK\00001_MCHP-CDB\Datasheets\M60-2p61.pdf; ComponentLink2Description: Local Datasheet; ComponentLink3URL: C:\ALTIUM_WORK\00001_MCHP-CDB\Library\LibraryRefs\Test Point.SchLib; ComponentLink3Description: Open Symbol; ComponentLink4URL: C:\ALTIUM_WORK\00001_MCHP-CDB\Library\Footprints\TP_3.8x2.03_SMD.PcbLib; ComponentLink4Description: Open Footprint; ComponentLink5Description: Open Footprint 2; ComponentLink6Description: Open Footprint 3; ComponentLink7Description: Open Footprint 4; Type: Test Point; Category: Connector; Manufacturer Part Number 1: 5019; Supplier 1: Digi-Key; Supplier Part Number 1: 36-5019CT-ND; Quantity Override: 1
U1_1 = 1042: Undefined or Miscellaneous; Manufacturer_Name: Keystone Electronics; Datasheet Link: http://www.mouser.com/ds/2/215/042-744829.pdf; Manufacturer_Part_Number: 1042; Mouser Part Number: 534-1042; Mouser Price/Stock: https://www.mouser.co.uk/ProductDetail/Keystone-Electronics/1042?qs=%2F7TOpeL5Mz4qPdWi9tuLKw%3D%3D
U3_1 = MIC2541: LDO; Manufacturer 1: Microchip; Manufacturer Part Number 1: MCP1702T-2802E/MB; Description_: MCHP ANALOG LDO 2.8V MCP1702T-2802E/MB SOT-89-3; Dev Tools Status: Production; Populated: Yes; MCHP-ID: MIC2541; Symbol: MCP170X SOT-89-3_TO-92-3; Type: LDO; Status: MCL Design; Revision: 0; Category: MCHP-Analog; ComponentLink1URL: https://www.microchip.com/sitesearch/search/Product%20and%20Development%20Tools/MCP1702T-2802E/MB; ComponentLink1Description: SVN Datasheet; ComponentLink2Description: Local Datasheet; ComponentLink3URL: C:\ALTIUM_WORK\00001_MCHP-CDB\Library\LibraryRefs\MCP170X SOT-89-3_TO-92-3.SchLib; ComponentLink3Description: Open Symbol; ComponentLink4URL: C:\ALTIUM_WORK\00001_MCHP-CDB\Library\Footprints\SOT-89-3.PcbLib; ComponentLink4Description: Open Footprint; ComponentLink5Description: Open Footprint 2; ComponentLink6Description: Open Footprint 3; ComponentLink7Description: Open Footprint 4; Supplier 1: Microchip; Supplier Part Number 1: MCP1702T-2802E/MB; Operating Temperature: -40C to +125C; Quantity Override: 1
U4_1 = CMP-0234-00069-3: MEMS motion sensor: Ultra low power high performance 3-axis nano accelerometer, -40 to +85°C, LGA-16 (3x3x1), Tape and Reel; Manufacturer: STMicroelectronics; PackageVersion: 2008; ComponentLink3Description: LIS331DLH Web Page; ComponentLink2Description: LIS331DLH Datasheet; RevisionNote: PCB layout corrected.; PackageDescription: 16-Pin Land Grid Array, 3 x 3 x 1 mm Body, 0.5 mm Pitch; PackageReference: LGA16-3X3X1; ComponentLink1URL: http://www.st.com/; ComponentLink1Description: Manufacturer URL; ComponentLink2URL: http://www.st.com/internet/com/TECHNICAL_RESOURCES/TECHNICAL_LITERATURE/DATASHEET/CD00213470.pdf; ComponentLink3URL: http://www.st.com/internet/analog/product/218132.jsp; DatasheetVersion: rev3, Jul-2009
U5_1 = CMP-08093-000006-1: IC USB TO UART BRIDGE QFN20
Y1_1 = OSC1250: Crystal; Manufacturer 1: Microchip Technology; Manufacturer Part Number 1: VMK3-9001-32K7680000; Description_: MCHP CRYSTAL 32.768kHz 9pF VMK3-9001-32K7680000 SMD L3.2W1.5XH0.9; Dev Tools Status: Production; Owner: Jesus Aviles; Tolerance: 20ppm; Load Capacitance: 9pF; Populated: YES; MCHP-ID: OSC1250; Revision: 2; Symbol: Crystal 2 Pins; Status: MCL Design; ComponentLink1URL: https://chn-vm-apps.microchip.com/mchprepo/parts/Datasheets/VMK3-9001-32K7680000-110919.pdf; ComponentLink1Description: SVN Datasheet; ComponentLink2URL: C:\ALTIUM_WORK\00001_MCHP-CDB\Datasheets\VMK3-9001-32K7680000-110919.pdf; ComponentLink2Description: Local Datasheet; ComponentLink3URL: C:\ALTIUM_WORK\00001_MCHP-CDB\Library\LibraryRefs\Crystal 2 Pins.SchLib; ComponentLink3Description: Open Symbol; ComponentLink4URL: C:\ALTIUM_WORK\00001_MCHP-CDB\Library\Footprints\CRYSTAL_FX135A_L3.2W1.5H0.9.PcbLib; ComponentLink4Description: Open Footprint; ComponentLink5Description: Open Footprint 2; ComponentLink6Description: Open Footprint 3; ComponentLink7Description: Open Footprint 4; Operating Temperature: -40C to +85C; Package: 2-Pin; Type: Crystal; Category: Crystal/Oscillator; Manufacturer 2: Microchip Technology; Manufacturer Part Number 2: VMK3-9001-32K7680000TR; Supplier 1: Microchip Technology; Supplier Part Number 1: VMK3-9001-32K7680000; Supplier 2: Microchip Technology; Supplier Part Number 2: VMK3-9001-32K7680000TR; Quantity Override: 1